# EAGLE design 6Dof (EAGLE 5.11)
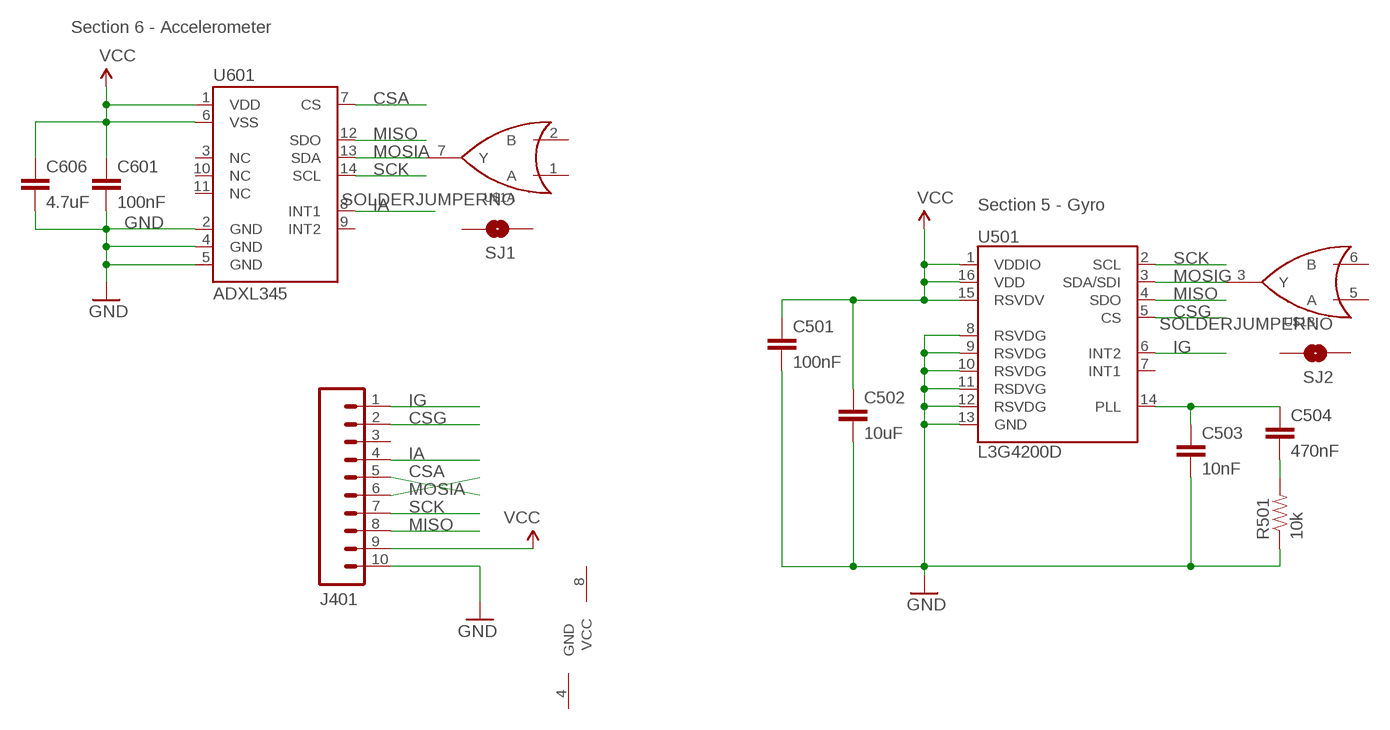
[diagram p0: schematic, sheet 1]

## Parts
C501  100nF  CAP0402-CAP  [0402-CAP]
C502  10uF  CAP0603-CAP  [0603-CAP]
C503  10nF  CAP0402-CAP  [0402-CAP]
C504  470nF  CAP0402-CAP  [0402-CAP]
C601  100nF  CAP0402-CAP  [0402-CAP]
C606  4.7uF  CAP0402-CAP  [0402-CAP]
J401  M10"  [1X10]
R501  10k  RESISTOR0402-RES  [0402-RES]
SJ1  SOLDERJUMPERNO  [SJ_2S-NO]
SJ2  SOLDERJUMPERNO  [SJ_2S-NO]
U501  L3G4200D  [LGA16-4X4]
U601  ADXL345  [LGA14]
U$1  SN74LVC2G32  [DCU_8]

## Nets
CSA: J401.6 U601.7(CS)
CSG: J401.2 U501.5(CS)
GND: C501.2 C502.2 C503.2 C601.2 C606.2 J401.10 R501.1 U501.8(RSVDG) U501.9(RSVDG) U501.10(RSVDG) U501.11(RSDVG) U501.12(RSVDG) U501.13(GND) U601.2(GND) U601.4(GND) U601.5(GND)
IA: J401.4 U601.8(INT1)
IG: J401.1 U501.6(INT2)
MISO: J401.8 U501.4(SDO) U601.12(SDO)
MOSIA: J401.5 U601.13(SDA) U$1.7(A:Y)
MOSIG: U501.3(SDA/SDI) U$1.3(B:Y)
N$1: C503.1 C504.1 U501.14(PLL)
N$2: C504.2 R501.2
SCK: J401.7 U501.2(SCL) U601.14(SCL)
VCC [POWER]: C501.1 C502.1 C601.1 C606.1 J401.9 U501.1(VDDIO) U501.15(RSVDV) U501.16(VDD) U601.1(VDD) U601.6(VSS)
Unconnected: J401.3 SJ1.1 SJ1.2 SJ2.1 SJ2.2 U501.7(INT1) U601.3(NC) U601.9(INT2) U601.10(NC) U601.11(NC) U$1.1(A:A) U$1.2(A:B) U$1.4(PWR:GND) U$1.5(B:A) U$1.6(B:B) U$1.8(PWR:VCC)

## Notes on the sheet
- Section 6 - Accelerometer
- Section 5 - Gyro

## Library data of the parts
C501-C504 C601 C606 = SparkFun:CAP: Capacitor Standard 0603 ceramic capacitor, and 0.1" leaded capacitor.
J401 = SparkFun:M10: Header 10 Standard 10-pin 0.1" header. Use with straight break away headers (SKU : PRT-00116), right angle break away headers (PRT-00553), swiss pins (PRT-00743), machine pins (PRT-00117), and female headers (PRT-00115).
R501 = SparkFun:RESISTOR: Resistor Basic schematic elements and footprints for 0603, 1206, and PTH resistors.
SJ1 SJ2 = SparkFun:SOLDERJUMPER: Solder Jumper Standard SMD solder jumper. Used to automate production. Two varients : Normally Open and Normally Closed are the same, but have different paste layers. NC will have a large amount of paste and should jumper during reflow.
U501 = SparkFun:L3G4200D: L3G4200D Three-axis, digital output gyroscope The L3G4200D is a low-power three-axis angular rate sensor, has a full scale of ±250/±500/±2000 dps and is capable of measuring rates with a user-selectable bandwidth. It includes a sensing element and an IC interface capable of providing the measured angular rate to the external world through a digital interface (I2C/SPI). Package: 4x4x1.1 LGA-16 (LGA16-4x4.PAC)
U601 = SparkFun:ADXL345
U$1 = KwanSystems:SN74LVC2G32; DIGIKEY: 296-13268-1-ND

## Net classes
0 default: width 0.152 mm, drill 0.33 mm, clearance 0.152 mm
1 POWER: width 0.152 mm, drill 0.33 mm, clearance 0.152 mm
2 hv: width 0.152 mm, drill 0.33 mm, clearance 0.152 mm

## Board
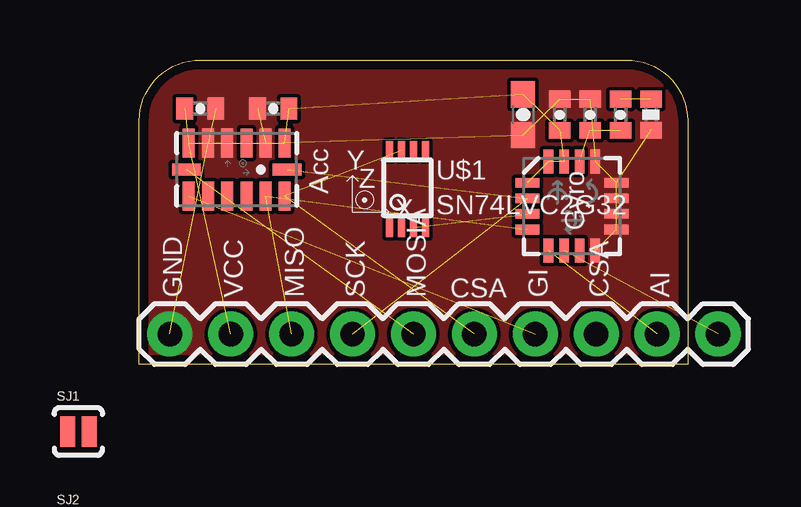
[diagram p1: board, top side]
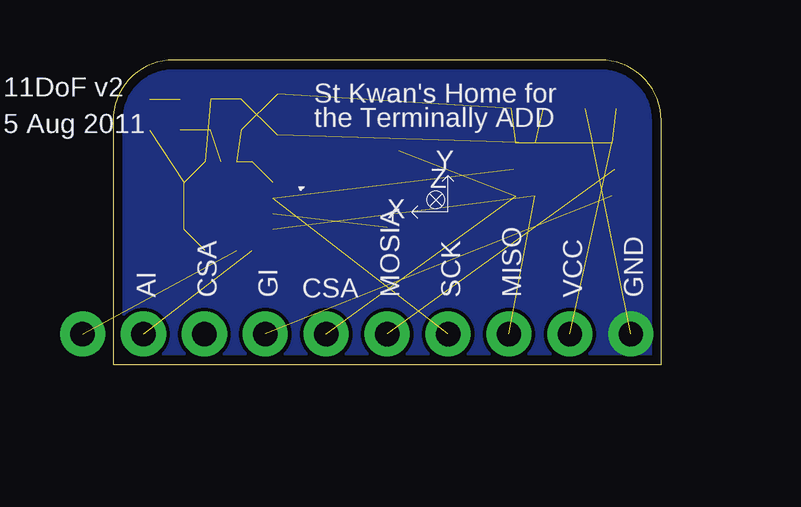
[diagram p2: board, bottom side, seen from below]

Size 22.86 x 12.7 mm. Coordinates in mm from the lower left corner, seen from the top.
Outline: 0,0 0,10.16 arc-90 2.54,12.7 20.32,12.7 arc-90 22.86,10.16 22.86,0 0,0
Copper layers (1*16): Top 0.0356mm / dielectric 1.5011mm / Bottom 0.0356mm
Design rules "LaenPCBOrder *": minimum track width 6mil, minimum drill 13mil, track to track 6mil, track to pad 6mil, pad to pad 6mil, via to via 6mil, smd to smd 6mil, copper to edge 15mil, drill to drill 6mil, minimum pad ring 7mil, minimum via ring 7mil, stop-mask expansion 4mil, vias tented up to drill 0mil, thermal gap 10mil

### Footprints (pad centres in the part's own frame; a part is rotated, then mirrored left to right if it is on the bottom)
0402-CAP = smd 0.7 x 0.9: 1 -0.65,0; 2 0.65,0
0603-CAP = smd 1.1 x 1: 1 -0.85,0; 2 0.85,0
1X10 = drill 1.016 pad 1.88 round: 1 0,0; 2 2.54,0; 3 5.08,0; 4 7.62,0; 5 10.16,0; 6 12.7,0; 7 15.24,0; 8 17.78,0; 9 20.32,0; 10 22.86,0
0402-RES = smd 0.7 x 0.9: 1 -0.65,0; 2 0.65,0
SJ_2S-NO = smd 0.635 x 1.27: 1 -0.45,0; 2 0.45,0
LGA16-4X4 = smd 1 x 0.4: 1 -1.85,0.975; 2 -1.85,0.325; 3 -1.85,-0.325; 4 -1.85,-0.975; 9 1.85,-0.975; 10 1.85,-0.325; 11 1.85,0.325; 12 1.85,0.975 | smd 0.4 x 1: 5 -0.975,-1.85; 6 -0.325,-1.85; 7 0.325,-1.85; 8 0.975,-1.85; 13 0.975,1.85; 14 0.325,1.85; 15 -0.325,1.85; 16 -0.975,1.85
LGA14 = smd 0.5 x 1.2: 1 2,1.1; 2 1.2,1.1; 3 0.4,1.1; 4 -0.4,1.1; 5 -1.2,1.1; 6 -2,1.1; 8 -2,-1.1; 9 -1.2,-1.1; 10 -0.4,-1.1; 11 0.4,-1.1; 12 1.2,-1.1; 13 2,-1.1 | smd 1.2 x 0.5: 7 -2.1,0; 14 2.1,0
DCU_8 = smd 0.3 x 0.8: 1 -0.75,-1.65; 2 -0.25,-1.65; 3 0.25,-1.65; 4 0.75,-1.65; 5 0.75,1.55; 6 0.25,1.55; 7 -0.25,1.55; 8 -0.75,1.55

### Placement (x,y rotation side)
C501  17.53,10.41 90 top
C502  16,10.41 270 top
C503  18.8,10.41 90 top
C504  20.07,10.41 90 top
C601  5.59,10.67 180 top
C606  2.54,10.67 0 top
J401  24.13,1.27 180 top
R501  21.34,10.41 90 top
SJ1  -2.54,-2.79 0 top
SJ2  -2.54,-7.11 0 top  (outside the outline)
U501  18.03,6.6 0 top
U601  4.06,8.13 0 top
U$1  11.18,7.37 0 top

### Tracks (layer width: path | path; a pad name or v marks a point on that pad's centre or on a via)
CSA  (1 unrouted)
CSG  (1 unrouted)
GND  (15 unrouted)
  pour Top (no thermals): 2.54,12.7 20.32,12.7 arc-90 22.86,10.16 22.86,0 0,0 0,10.16 arc-90
  pour Bottom (no thermals): 2.54,12.7 20.32,12.7 arc-90 22.86,10.16 22.86,0 0,0 0,10.16 arc-90
IA  (1 unrouted)
IG  (1 unrouted)
MISO  (2 unrouted)
MOSIA  (2 unrouted)
MOSIG  (1 unrouted)
N$1  (2 unrouted)
N$2  (1 unrouted)
SCK  (2 unrouted)
VCC  (9 unrouted)

### Text on the board
tPlace: Y | Acc | Z | X | Gyro | GND | VCC | MISO | SCK | MOSIA | CSA | GI | CSA | AI
bPlace: St Kwan's Home for | 11DoF v2 | the Terminally ADD | 5 Aug 2011 | Y | Z | X
bNames: GND | VCC | MISO | SCK | MOSIA | CSA | GI | CSA | AI